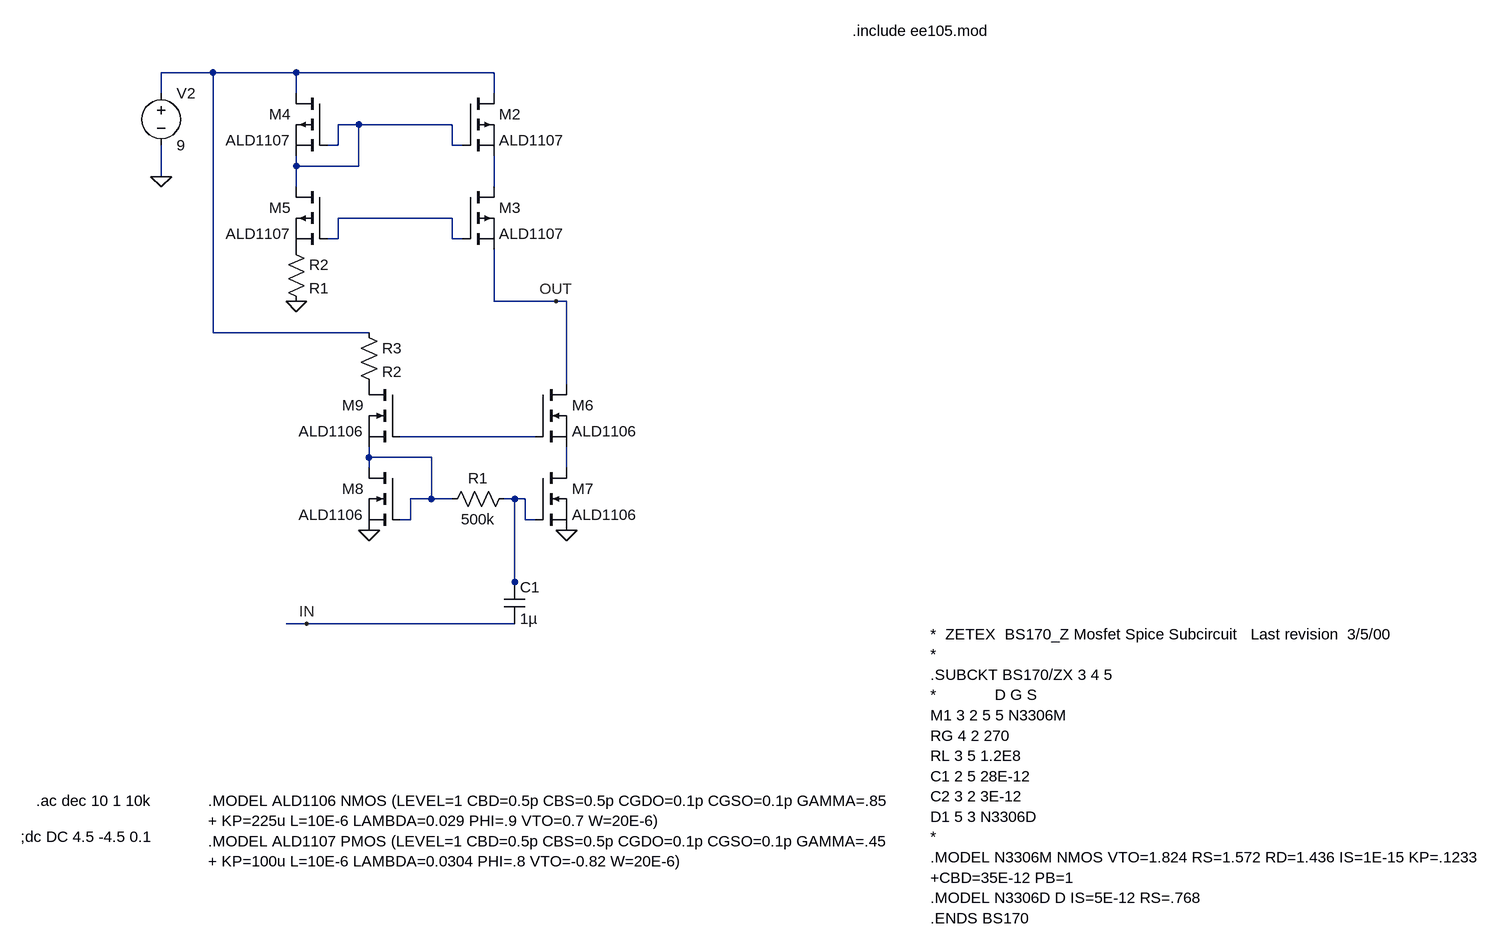
[diagram p0: schematic Cascode.asc]
Cascode.asc, the LTspice schematic file:
Version 4
SHEET 1 1760 1060
WIRE -256 -144 -336 -144
WIRE -128 -144 -256 -144
WIRE 176 -144 -128 -144
WIRE -336 -112 -336 -144
WIRE -128 -112 -128 -144
WIRE 176 -112 176 -144
WIRE -32 -64 -64 -64
WIRE 112 -64 -32 -64
WIRE -64 -32 -64 -64
WIRE -64 -32 -80 -32
WIRE 112 -32 112 -64
WIRE 128 -32 112 -32
WIRE -128 0 -128 -16
WIRE -32 0 -32 -64
WIRE -32 0 -128 0
WIRE -336 16 -336 -32
WIRE -128 32 -128 0
WIRE 176 32 176 -16
WIRE 112 80 -64 80
WIRE -64 112 -64 80
WIRE -64 112 -80 112
WIRE 112 112 112 80
WIRE 128 112 112 112
WIRE 176 208 176 128
WIRE 272 208 176 208
WIRE 288 208 272 208
WIRE -256 256 -256 -144
WIRE -16 256 -256 256
WIRE 288 336 288 208
WIRE 240 416 32 416
WIRE -16 448 -16 432
WIRE 80 448 -16 448
WIRE -16 464 -16 448
WIRE 288 464 288 432
WIRE 80 512 80 448
WIRE 80 512 48 512
WIRE 112 512 80 512
WIRE 208 512 192 512
WIRE 224 512 208 512
WIRE 48 544 48 512
WIRE 48 544 32 544
WIRE 224 544 224 512
WIRE 240 544 224 544
WIRE 208 640 208 512
WIRE 208 656 208 640
WIRE -112 704 -144 704
WIRE 208 704 -112 704
FLAG -336 16 0
FLAG 288 560 0
FLAG -16 560 0
FLAG -128 208 0
FLAG 272 208 OUT
FLAG -112 704 IN
SYMBOL res 208 496 R90
WINDOW 0 0 56 VBottom 2
WINDOW 3 32 56 VTop 2
SYMATTR InstName R1
SYMATTR Value 500k
SYMBOL voltage -336 -128 R0
WINDOW 123 0 0 Left 2
WINDOW 39 0 0 Left 2
SYMATTR InstName V2
SYMATTR Value 9
SYMBOL cap 192 640 R0
SYMATTR InstName C1
SYMATTR Value 1µ
SYMBOL pmos 128 -112 R0
SYMATTR InstName M2
SYMATTR Value ALD1107
SYMBOL pmos 128 32 R0
SYMATTR InstName M3
SYMATTR Value ALD1107
SYMBOL pmos -80 -112 M0
SYMATTR InstName M4
SYMATTR Value ALD1107
SYMBOL pmos -80 32 M0
SYMATTR InstName M5
SYMATTR Value ALD1107
SYMBOL nmos 240 336 R0
SYMATTR InstName M6
SYMATTR Value ALD1106
SYMATTR Prefix X
SYMBOL nmos 240 464 R0
SYMATTR InstName M7
SYMATTR Value ALD1106
SYMATTR Prefix X
SYMBOL nmos 32 464 M0
SYMATTR InstName M8
SYMATTR Value ALD1106
SYMATTR Prefix X
SYMBOL nmos 32 336 M0
SYMATTR InstName M9
SYMATTR Value ALD1106
SYMATTR Prefix X
SYMBOL res -144 112 R0
SYMATTR InstName R2
SYMATTR Value R1
SYMBOL res -32 240 R0
SYMATTR InstName R3
SYMATTR Value R2
TEXT 728 -208 Left 2 !.include ee105.mod
TEXT -528 976 Left 2 !.ac dec 10 1 10k
TEXT -552 1032 Left 2 !;dc DC 4.5 -4.5 0.1
TEXT 848 720 Left 2 !*  ZETEX  BS170_Z Mosfet Spice Subcircuit   Last revision  3/5/00\n*\n.SUBCKT BS170/ZX 3 4 5\n*             D G S\nM1 3 2 5 5 N3306M\nRG 4 2 270\nRL 3 5 1.2E8\nC1 2 5 28E-12\nC2 3 2 3E-12 \nD1 5 3 N3306D\n*\n.MODEL N3306M NMOS VTO=1.824 RS=1.572 RD=1.436 IS=1E-15 KP=.1233\n+CBD=35E-12 PB=1\n.MODEL N3306D D IS=5E-12 RS=.768\n.ENDS BS170
TEXT -264 976 Left 2 !.MODEL ALD1106 NMOS (LEVEL=1 CBD=0.5p CBS=0.5p CGDO=0.1p CGSO=0.1p GAMMA=.85\n+ KP=225u L=10E-6 LAMBDA=0.029 PHI=.9 VTO=0.7 W=20E-6)\n.MODEL ALD1107 PMOS (LEVEL=1 CBD=0.5p CBS=0.5p CGDO=0.1p CGSO=0.1p GAMMA=.45\n+ KP=100u L=10E-6 LAMBDA=0.0304 PHI=.8 VTO=-0.82 W=20E-6)

The netlist it stands for:
* Cascode.asc
R1 N008 N006 500k
V2 N001 0 9
C1 N008 IN 1µ
M2 N001 N002 N003 N003 ALD1107
M3 N003 N004 OUT OUT ALD1107
M4 N001 N002 N002 N002 ALD1107
M5 N002 N004 P001 P001 ALD1107
XM6 OUT N005 N007 ALD1106  ; pins D G S
XM7 N007 N008 0 ALD1106  ; pins D G S
XM8 N006 N006 0 ALD1106  ; pins D G S
XM9 P002 N005 N006 ALD1106  ; pins D G S
R2 P001 0 R1
R3 N001 P002 R2
.model NMOS NMOS
.model PMOS PMOS
.lib standard.mos
.include ee105.mod
.ac dec 10 1 10k
;dc DC 4.5 -4.5 0.1
*  ZETEX  BS170_Z Mosfet Spice Subcircuit   Last revision  3/5/00
*
.SUBCKT BS170/ZX 3 4 5
*             D G S
M1 3 2 5 5 N3306M
RG 4 2 270
RL 3 5 1.2E8
C1 2 5 28E-12
C2 3 2 3E-12
D1 5 3 N3306D
*
.MODEL N3306M NMOS VTO=1.824 RS=1.572 RD=1.436 IS=1E-15 KP=.1233
+CBD=35E-12 PB=1
.MODEL N3306D D IS=5E-12 RS=.768
.ENDS BS170
.MODEL ALD1106 NMOS (LEVEL=1 CBD=0.5p CBS=0.5p CGDO=0.1p CGSO=0.1p GAMMA=.85
+ KP=225u L=10E-6 LAMBDA=0.029 PHI=.9 VTO=0.7 W=20E-6)
.MODEL ALD1107 PMOS (LEVEL=1 CBD=0.5p CBS=0.5p CGDO=0.1p CGSO=0.1p GAMMA=.45
+ KP=100u L=10E-6 LAMBDA=0.0304 PHI=.8 VTO=-0.82 W=20E-6)
.backanno
.end